# Altium schematic sheet Level Shifting.SchDoc
size A4; SheetNumber: 9; SheetTotal: 10
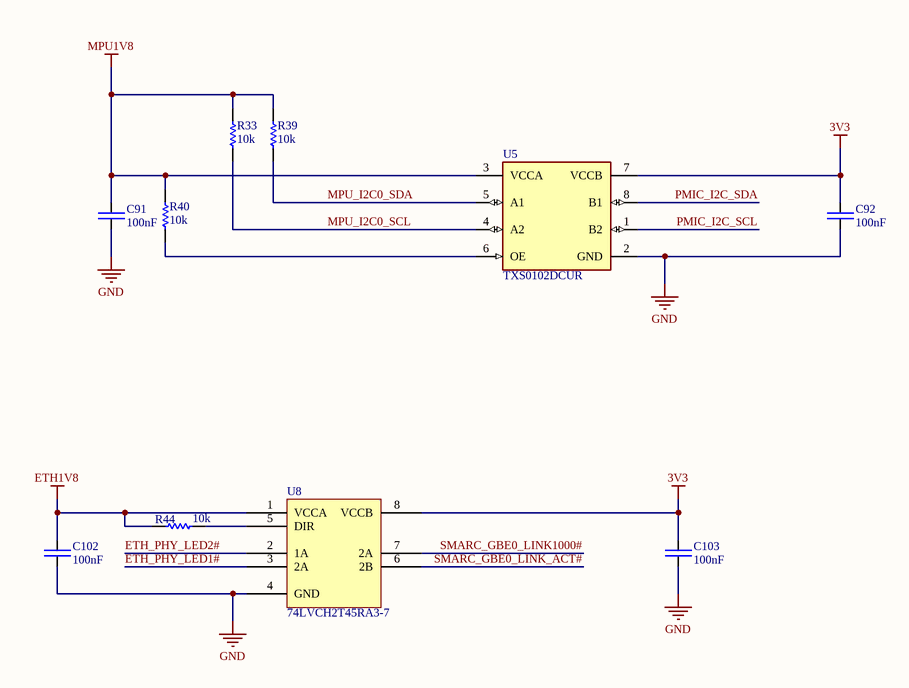
[diagram p0: Level Shifting.SchDoc]

## Parts
C91  100nF  [CAP-0603]
C92  100nF  [CAP-0603]
C102  100nF  [CAP-0201]
C103  100nF  [CAP-0201]
R33  10k  [RES-0603]
R39  10k  [RES-0603]
R40  10k  [RES-0603]
R44  10k  [RES-0201]
U5  TXS0102DCUR  [FP-DCU0008A-MFG]
U8  74LVCH2T45RA3-7  [74LVCH2T45RA3-7]

## Nets
3V3: C92.2 C103.2 U5.7(VCCB) U8.8(VCCB)
ETH1V8: C102.2 R44.1 U8.1(VCCA)
GND: C91.1 C92.1 C102.1 C103.1 U5.2(GND) U8.4(GND)
MPU1V8: C91.2 R33.2 R39.2 R40.2 U5.3(VCCA)
ETH_PHY_LED1#: U8.3(2A)
ETH_PHY_LED2#: U8.2(1A)
MPU_I2C0_SCL: R33.1 U5.4(A2)
MPU_I2C0_SDA: R39.1 U5.5(A1)
PMIC_I2C_SCL: U5.1(B2)
PMIC_I2C_SDA: U5.8(B1)
SMARC_GBE0_LINK1000#: U8.7(2A)
SMARC_GBE0_LINK_ACT#: U8.6(2B)
NetR40_1: R40.1 U5.6(OE)
NetR44_2: R44.2 U8.5(DIR)

## Library data of the parts
C91 C92 = CAP-0603: Capacitor chip unpolarized. 0603
C102 C103 = CAP-0201: Capacitor chip upolarized. 0201
R33 R39 R40 = RES-0603: Resistor chip. 0603
R44 = RES-0201: Resistor chip. 0201
U5 = CMP-0859-00001-2: IC TRNSLTR BIDIRECTIONAL US8; Manufacturer: Texas Instruments; Number Of Circuits: 1; Number Of Inputs: 2; Data Rate: 24Mbits/s; Max Junction Temp: +150°C; V A Min: 1.65V; Standoff Height: 0mm; Logic Function Desc: Bidirectional Voltage-Level Translator; Max Supply Voltage: 5.5V; V A Max: 3.6V; Nominal Supply Current: 1-14.4uA; V B Min: 2.3V; Temperature: -40°C to +85°C; Temperature Range Low: -40°C; Height: 0.9mm; Device Class L1: Integrated Circuits (ICs); RoHS: TRUE; Min Supply Voltage: 1.65V; Digikey Description: IC TRNSLTR BIDIRECTIONAL US8; ComponentLink2Description: Datasheet; Octopart: https://octopart.com/txs0102dcur-texas+instruments-5414308; Temperature Range High: +85°C; Device Class L2: Logic ICs; Category: IC; Ambient Temperature Range High: +85°C; Automotive: No; Manufacturer Part Number: TXS0102DCUR; Device Class L3: Voltage Level Shifters; Number Of Outputs: 2; Ambient Temperature Range Low: -40°C; Lead Free: Yes; ComponentLink2URL: http://www.ti.com/lit/ds/symlink/txs0102.pdf; V B Max: 5.5V; Package: DCU0008A; Mouser Description: Translation - Voltage Levels 2-Bit Bi-Directional Voltage-Level-Trans
U8 = 74LVCH2T45RA3-7: Level shifter dual input bidirectional